# Altium schematic sheet Schematic.SchDoc
size A4
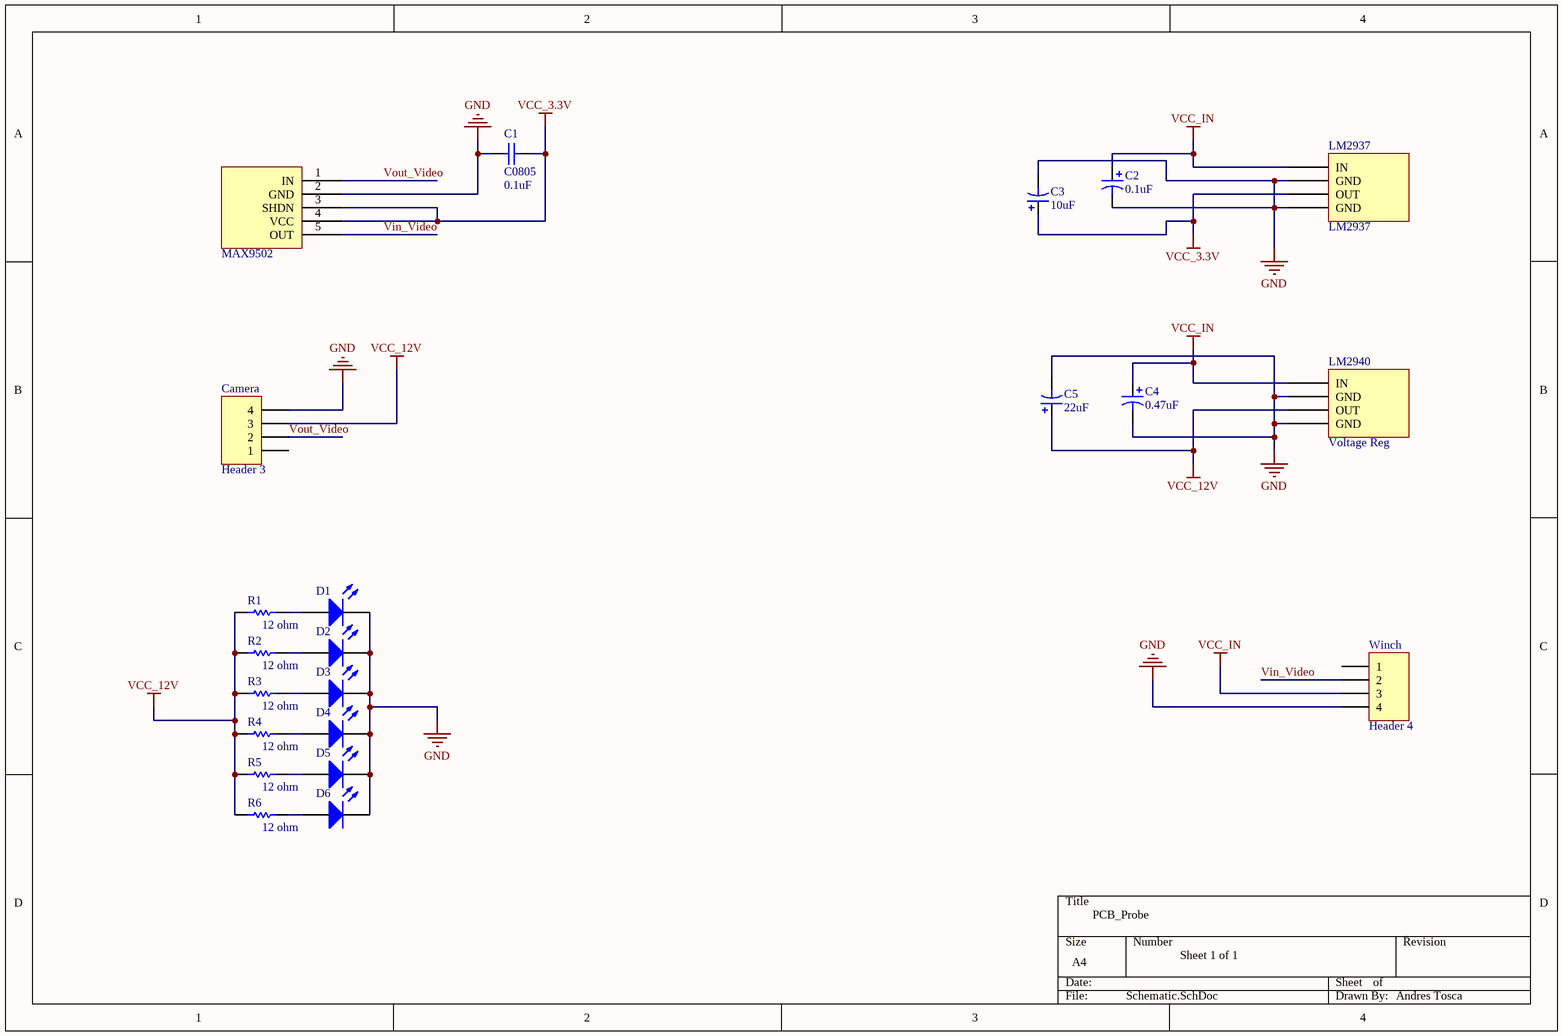
[diagram p0: Schematic.SchDoc]

## Parts
*  MAX9502  [SOT65P210X110-5N]
C1  C0805  value 0.1uF  [CAP_KEMET0.1UF]
C2  value 0.1uF  [CAP_KEMET]  (hidden comment: Cap Pol1)
C3  value 10uF  [CAPM6032]  (hidden comment: Cap Pol1)
C4  value 0.47uF  [CAP_KEMET]  (hidden comment: Cap Pol1)
C5  value 22uF  [CAPM6032]  (hidden comment: Cap Pol1)
Camera  Header 3  [MOLEX_4CIRCUITS]
D1  LED3  [LED_NeutralWhite]  (value not drawn)
D2  LED3  [LED_NeutralWhite]  (value not drawn)
D3  LED3  [LED_NeutralWhite]  (value not drawn)
D4  LED3  [LED_NeutralWhite]  (value not drawn)
D5  LED3  [LED_NeutralWhite]  (value not drawn)
D6  LED3  [LED_NeutralWhite]  (value not drawn)
LM2937  LM2937  [SOT223127P600-8N]
LM2940  Voltage Reg  [SOT223_LM2940]
R1  value 12 ohm  [AXIAL-0.3]  (hidden comment: Res1)
R2  value 12 ohm  [AXIAL-0.3]  (hidden comment: Res1)
R3  value 12 ohm  [AXIAL-0.3]  (hidden comment: Res1)
R4  value 12 ohm  [AXIAL-0.3]  (hidden comment: Res1)
R5  value 12 ohm  [AXIAL-0.3]  (hidden comment: Res1)
R6  value 12 ohm  [AXIAL-0.3]  (hidden comment: Res1)
Winch  Header 4  [MOLEX_4CIRCUITS]

## Nets
GND: *.2(GND) C1.2 C2.2 C3.2 C4.2 C5.2 Camera.4 D1.2(K) D2.2(K) D3.2(K) D4.2(K) D5.2(K) D6.2(K) LM2937.2(GND) LM2937.4(GND) LM2940.2(GND) LM2940.4(GND) Winch.4
VCC_3.3V: *.3(SHDN) *.4(VCC) C1.1 C3.1 LM2937.3(OUT)
VCC_12V: C5.1 Camera.3 LM2940.3(OUT) R1.1 R2.1 R3.1 R4.1 R5.1 R6.1
VCC_IN: C2.1 C4.1 LM2937.1(IN) LM2940.1(IN) Winch.3
Vin_Video: *.5(OUT) Winch.2
Vout_Video: *.1(IN) Camera.2
NetD1_1: D1.1(A) R1.2
NetD2_1: D2.1(A) R2.2
NetD3_1: D3.1(A) R3.2
NetD4_1: D4.1(A) R4.2
NetD5_1: D5.1(A) R5.2
NetD6_1: D6.1(A) R6.2

Not connected (* = marked no-connect by the designer): Camera 1; Winch 1

## Notes on the sheet
- PCB_Probe
- Sheet 1 of 1
- Andres Tosca

## Library data of the parts
C1 = C0805: Ceramic Chip Capacitor - Standard; Note: Footprint corresponds to dimensions for bulk cassette packaging. This case size has tightened tolerances.; Published: 17-Jul-2002; LatestRevisionDate: 19-Mar-2004; LatestRevisionNote: Silkscreen size reduced.; DatasheetDocument: Mar-2001; PackageDocument: Mar-2001; PackageReference: 0805; Publisher: Altium Limited; Code_JEITA: 0805; Code_IPC: 2012[0805]; ComponentLink1Description: Manufacturer Link; ComponentLink1URL: http://www.kemet.com/; ComponentLink2Description: Datasheet; ComponentLink2URL: http://www.kemet.com/kemet/web/homepage/kechome.nsf/vapubfilesname/F3102TA.pdf/$file/F3102TA.pdf
C2-C5 = Cap Pol1: Polarized Capacitor (Radial); Published: 8-Jun-2000; LatestRevisionDate: 17-Jul-2002; LatestRevisionNote: Re-released for DXP Platform.; PackageReference: RB7.6-15; Publisher: Altium Limited; PackageDescription: Polarized Capacitor (Radial); 2 Leads
Camera Winch = Header 4: Header, 4-Pin; LatestRevisionDate: 17-Jul-2002; LatestRevisionNote: Re-released for DXP Platform.; Publisher: Altium Limited
D1-D6 = LED3: Typical BLUE SiC LED; Published: 8-Jun-2000; LatestRevisionDate: 17-Dec-2003; LatestRevisionNote: PCB Footprint replaced.; DatasheetVersion: 16-Apr-2002; PackageVersion: 16-Apr-2002; PackageReference: 3.5X2.8X1.9; Publisher: Altium Limited; PackageDescription: SM LED; 2 C-Bend Leads; Body 3.5 x 2.8 x 1.9 mm, inc leads (LxWxH typ)
LM2937 = LM1117
R1-R6 = Res1: Resistor; Published: 8-Jun-2000; LatestRevisionDate: 17-Jul-2002; LatestRevisionNote: Re-released for DXP Platform.; PackageReference: AXIAL-0.3; Publisher: Altium Limited; PackageDescription: Axial Device, Thru-Hole; 2 Leads; 0.3 in Pin Spacing